# Altium schematic sheet mgmt.SchDoc
size A
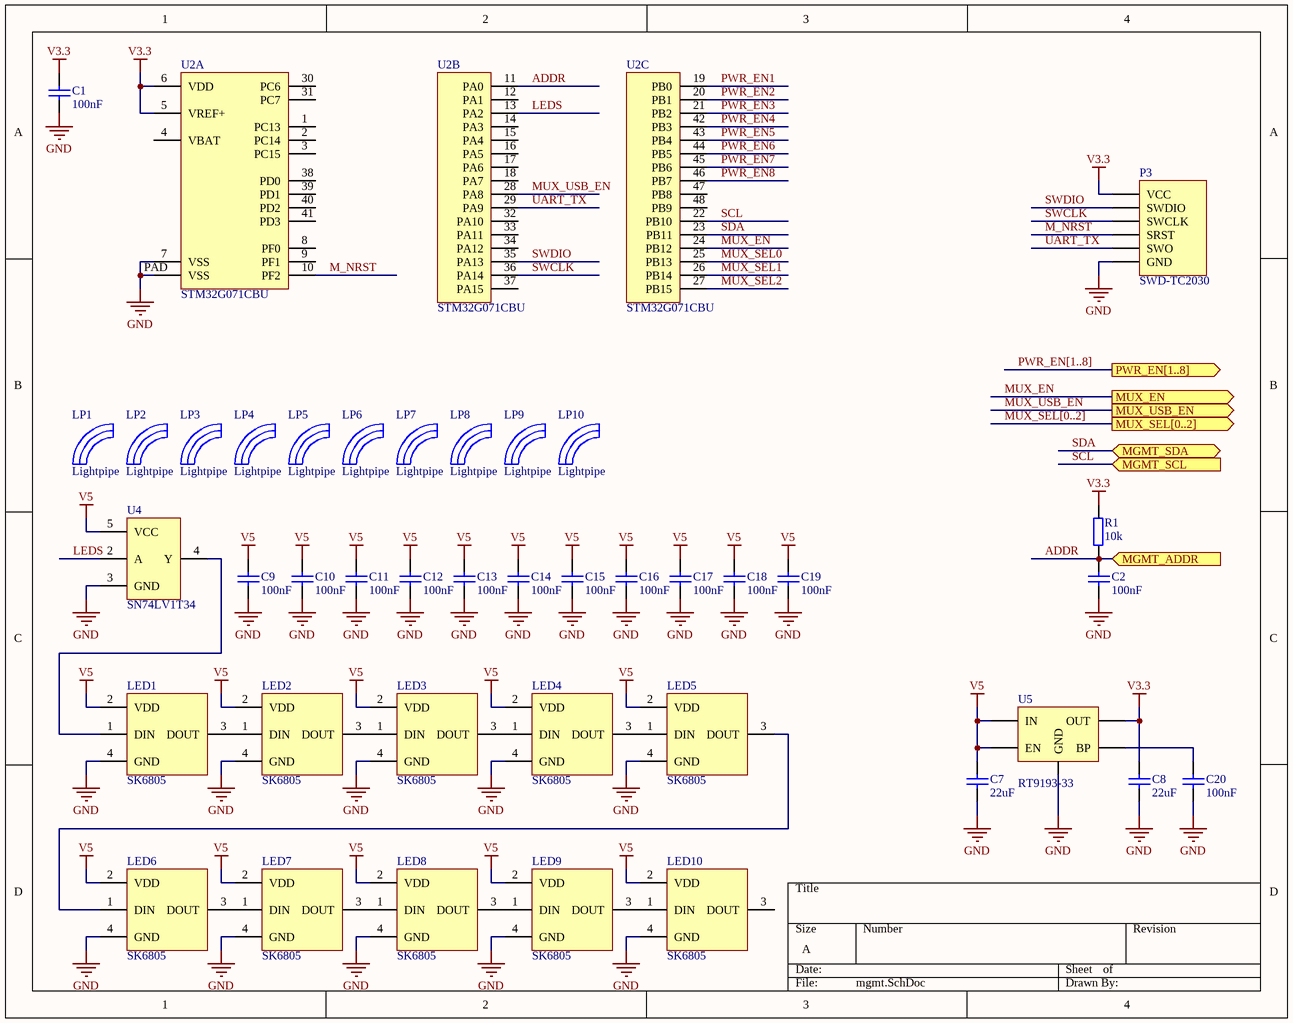
[diagram p0: mgmt.SchDoc]

## Parts
C1  100nF  [0402]
C2  100nF  [0402]
C7  22uF  [0805]
C8  22uF  [0805]
C9  100nF  [0402]
C10  100nF  [0402]
C11  100nF  [0402]
C12  100nF  [0402]
C13  100nF  [0402]
C14  100nF  [0402]
C15  100nF  [0402]
C16  100nF  [0402]
C17  100nF  [0402]
C18  100nF  [0402]
C19  100nF  [0402]
C20  100nF  [0402]
LED1  SK6805  [EC15]
LED2  SK6805  [EC15]
LED3  SK6805  [EC15]
LED4  SK6805  [EC15]
LED5  SK6805  [EC15]
LED6  SK6805  [EC15]
LED7  SK6805  [EC15]
LED8  SK6805  [EC15]
LED9  SK6805  [EC15]
LED10  SK6805  [EC15]
LP1  Lightpipe  [SLP3-150-100-F]
LP2  Lightpipe  [SLP3-150-100-F]
LP3  Lightpipe  [SLP3-150-100-F]
LP4  Lightpipe  [SLP3-150-100-F]
LP5  Lightpipe  [SLP3-150-100-F]
LP6  Lightpipe  [SLP3-150-100-F]
LP7  Lightpipe  [SLP3-150-100-F]
LP8  Lightpipe  [SLP3-150-100-F]
LP9  Lightpipe  [SLP3-150-100-F]
LP10  Lightpipe  [SLP3-150-100-F]
P3  SWD-TC2030  [TC2030-NL]
R1  10k  [0402]
U2  STM32G071CBU  [QFN50P690X710X60_HS-49N]  (parts A,B,C of 3)
U4  SN74LV1T34  [SOT23-5]
U5  RT9193-33  [SOT23-5]

## Ports
MGMT_ADDR (in), MGMT_SCL (in), MGMT_SDA (bidir), MUX_EN (out), MUX_SEL[0..2] (out), MUX_USB_EN (out), PWR_EN[1..8] (out)

## Nets
GND: C1.1 C2.1 C7.1 C8.1 C9.1 C10.1 C11.1 C12.1 C13.1 C14.1 C15.1 C16.1 C17.1 C18.1 C19.1 C20.1 LED1.4(GND) LED2.4(GND) LED3.4(GND) LED4.4(GND) LED5.4(GND) LED6.4(GND) LED7.4(GND) LED8.4(GND) LED9.4(GND) LED10.4(GND) P3.GND U2.7(VSS) U2.PAD(VSS) U4.3(GND) U5.GND
V3.3: C1.2 C8.2 P3.VCC R1.2 U2.5(VREF+) U2.6(VDD) U5.OUT
V5: C7.2 C9.2 C10.2 C11.2 C12.2 C13.2 C14.2 C15.2 C16.2 C17.2 C18.2 C19.2 LED1.2(VDD) LED2.2(VDD) LED3.2(VDD) LED4.2(VDD) LED5.2(VDD) LED6.2(VDD) LED7.2(VDD) LED8.2(VDD) LED9.2(VDD) LED10.2(VDD) U4.5(VCC) U5.EN U5.IN
ADDR: C2.2 R1.1 U2.11(PA0) ; port MGMT_ADDR
LEDS: U2.13(PA2) U4.2(A)
M_NRST: P3.SRST U2.10(PF2)
MUX_EN: U2.24(PB12) ; port MUX_EN
MUX_SEL0: U2.25(PB13)
MUX_SEL1: U2.26(PB14)
MUX_SEL2: U2.27(PB15)
MUX_USB_EN: U2.28(PA8) ; port MUX_USB_EN
PWR_EN1: U2.19(PB0)
PWR_EN2: U2.20(PB1)
PWR_EN3: U2.21(PB2)
PWR_EN4: U2.42(PB3)
PWR_EN5: U2.43(PB4)
PWR_EN6: U2.44(PB5)
PWR_EN7: U2.45(PB6)
PWR_EN8: U2.46(PB7)
SCL: U2.22(PB10) ; port MGMT_SCL
SDA: U2.23(PB11) ; port MGMT_SDA
SWCLK: P3.SWCLK U2.36(PA14)
SWDIO: P3.SWDIO U2.35(PA13)
UART_TX: P3.SWO U2.29(PA9)
NetC20_2: C20.2 U5.BP
NetLED1_1: LED1.1(DIN) U4.4(Y)
NetLED1_3: LED1.3(DOUT) LED2.1(DIN)
NetLED2_3: LED2.3(DOUT) LED3.1(DIN)
NetLED3_3: LED3.3(DOUT) LED4.1(DIN)
NetLED4_3: LED4.3(DOUT) LED5.1(DIN)
NetLED5_3: LED5.3(DOUT) LED6.1(DIN)
NetLED6_3: LED6.3(DOUT) LED7.1(DIN)
NetLED7_3: LED7.3(DOUT) LED8.1(DIN)
NetLED8_3: LED8.3(DOUT) LED9.1(DIN)
NetLED9_3: LED9.3(DOUT) LED10.1(DIN)

Not connected (* = marked no-connect by the designer): LED10 3(DOUT); U2 1(PC13) 2(PC14) 3(PC15) 4(VBAT) 8(PF0) 9(PF1) 12(PA1) 14(PA3) 15(PA4) 16(PA5) 17(PA6) 18(PA7) 30(PC6) 31(PC7) 32(PA10) 33(PA11) 34(PA12) 37(PA15) 38(PD0) 39(PD1) 40(PD2) 41(PD3) 47(PB8) 48(PB9)

## Buses and harness runs
bus MUX_SEL[0..2] = port MUX_SEL[0..2]
bus PWR_EN[1..8] = port PWR_EN[1..8]

## Library data of the parts
C1 C2 C7-C20 = Capacitor
  C1 C2 C9-C20: Value: 100nF
  C7 C8: Value: 22uF
P3 = SWD-TC2030: pin to pad: GND>5 SRST>3 SWCLK>4 SWDIO>2 SWO>6 VCC>1
R1 = Resistor: Value: 10k
U2 = STM32G0B1CxU
U4 = SN74LV1T34: Single Power Supply Single Buffer GATE CMOS Logic Level Shifter
U5 = VREG_EN_BP: pin to pad: BP>4 EN>3 GND>2 IN>1 OUT>5